# Altium schematic sheet ToC.SchDoc: Audio Research: Table of Contents
size A4; DrawnBy: Connor Dack; Engineer: Connor Dack; DocumentNumber: 2; Revision: 1.0; SheetNumber: 2; SheetTotal: 20
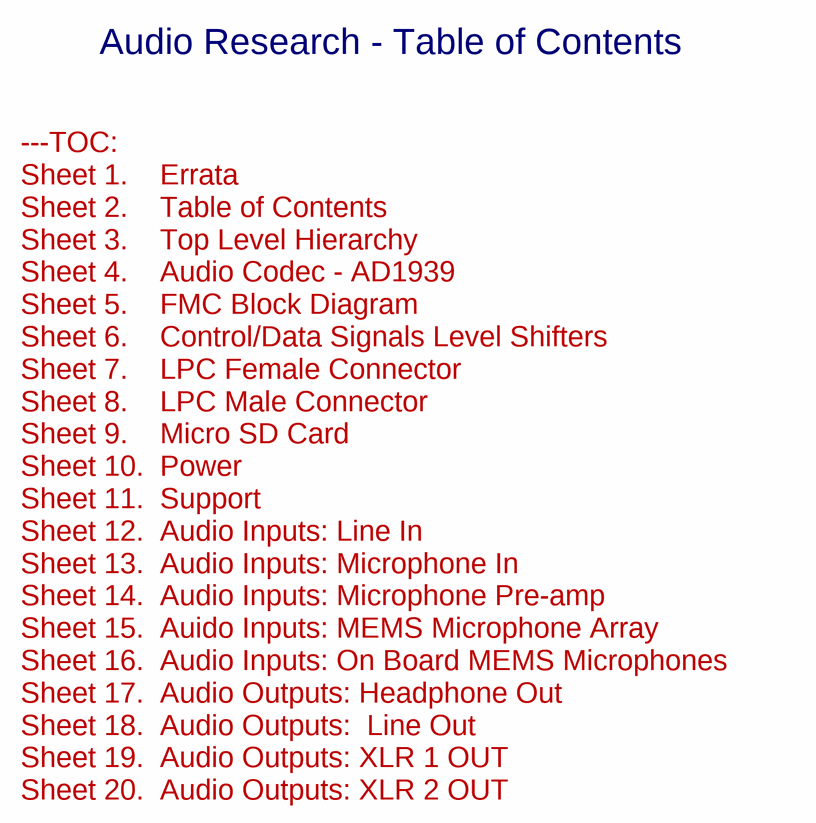
[diagram p0: ToC.SchDoc]

## Notes on the sheet
- Audio Research - Table of Contents
- ---TOC:
  Sheet 1.    Errata
  Sheet 2.    Table of Contents
  Sheet 3.    Top Level Hierarchy
  Sheet 4.    Audio Codec - AD1939
  Sheet 5.    FMC Block Diagram
  Sheet 6.    Control/Data Signals Level Shifters
  Sheet 7.    LPC Female Connector
  Sheet 8.    LPC Male Connector
  Sheet 9.    Micro SD Card
  Sheet 10.  Power
  Sheet 11.  Support
  Sheet 12.  Audio Inputs: Line In
  Sheet 13.  Audio Inputs: Microphone In
  Sheet 14.  Audio Inputs: Microphone Pre-amp
  Sheet 15.  Auido Inputs: MEMS Microphone Array
  Sheet 16.  Audio Inputs: On Board MEMS Microphones
  Sheet 17.  Audio Outputs: Headphone Out
  Sheet 18.  Audio Outputs:  Line Out
  Sheet 19.  Audio Outputs: XLR 1 OUT
  Sheet 20.  Audio Outputs: XLR 2 OUT
- Title:
- Sheet:
- of
- Size:
- A4
- Rev:
- Date:
- Engineer:
- Time:
- File: